# Altium schematic sheet STM32最小系统.SchDoc
size A3
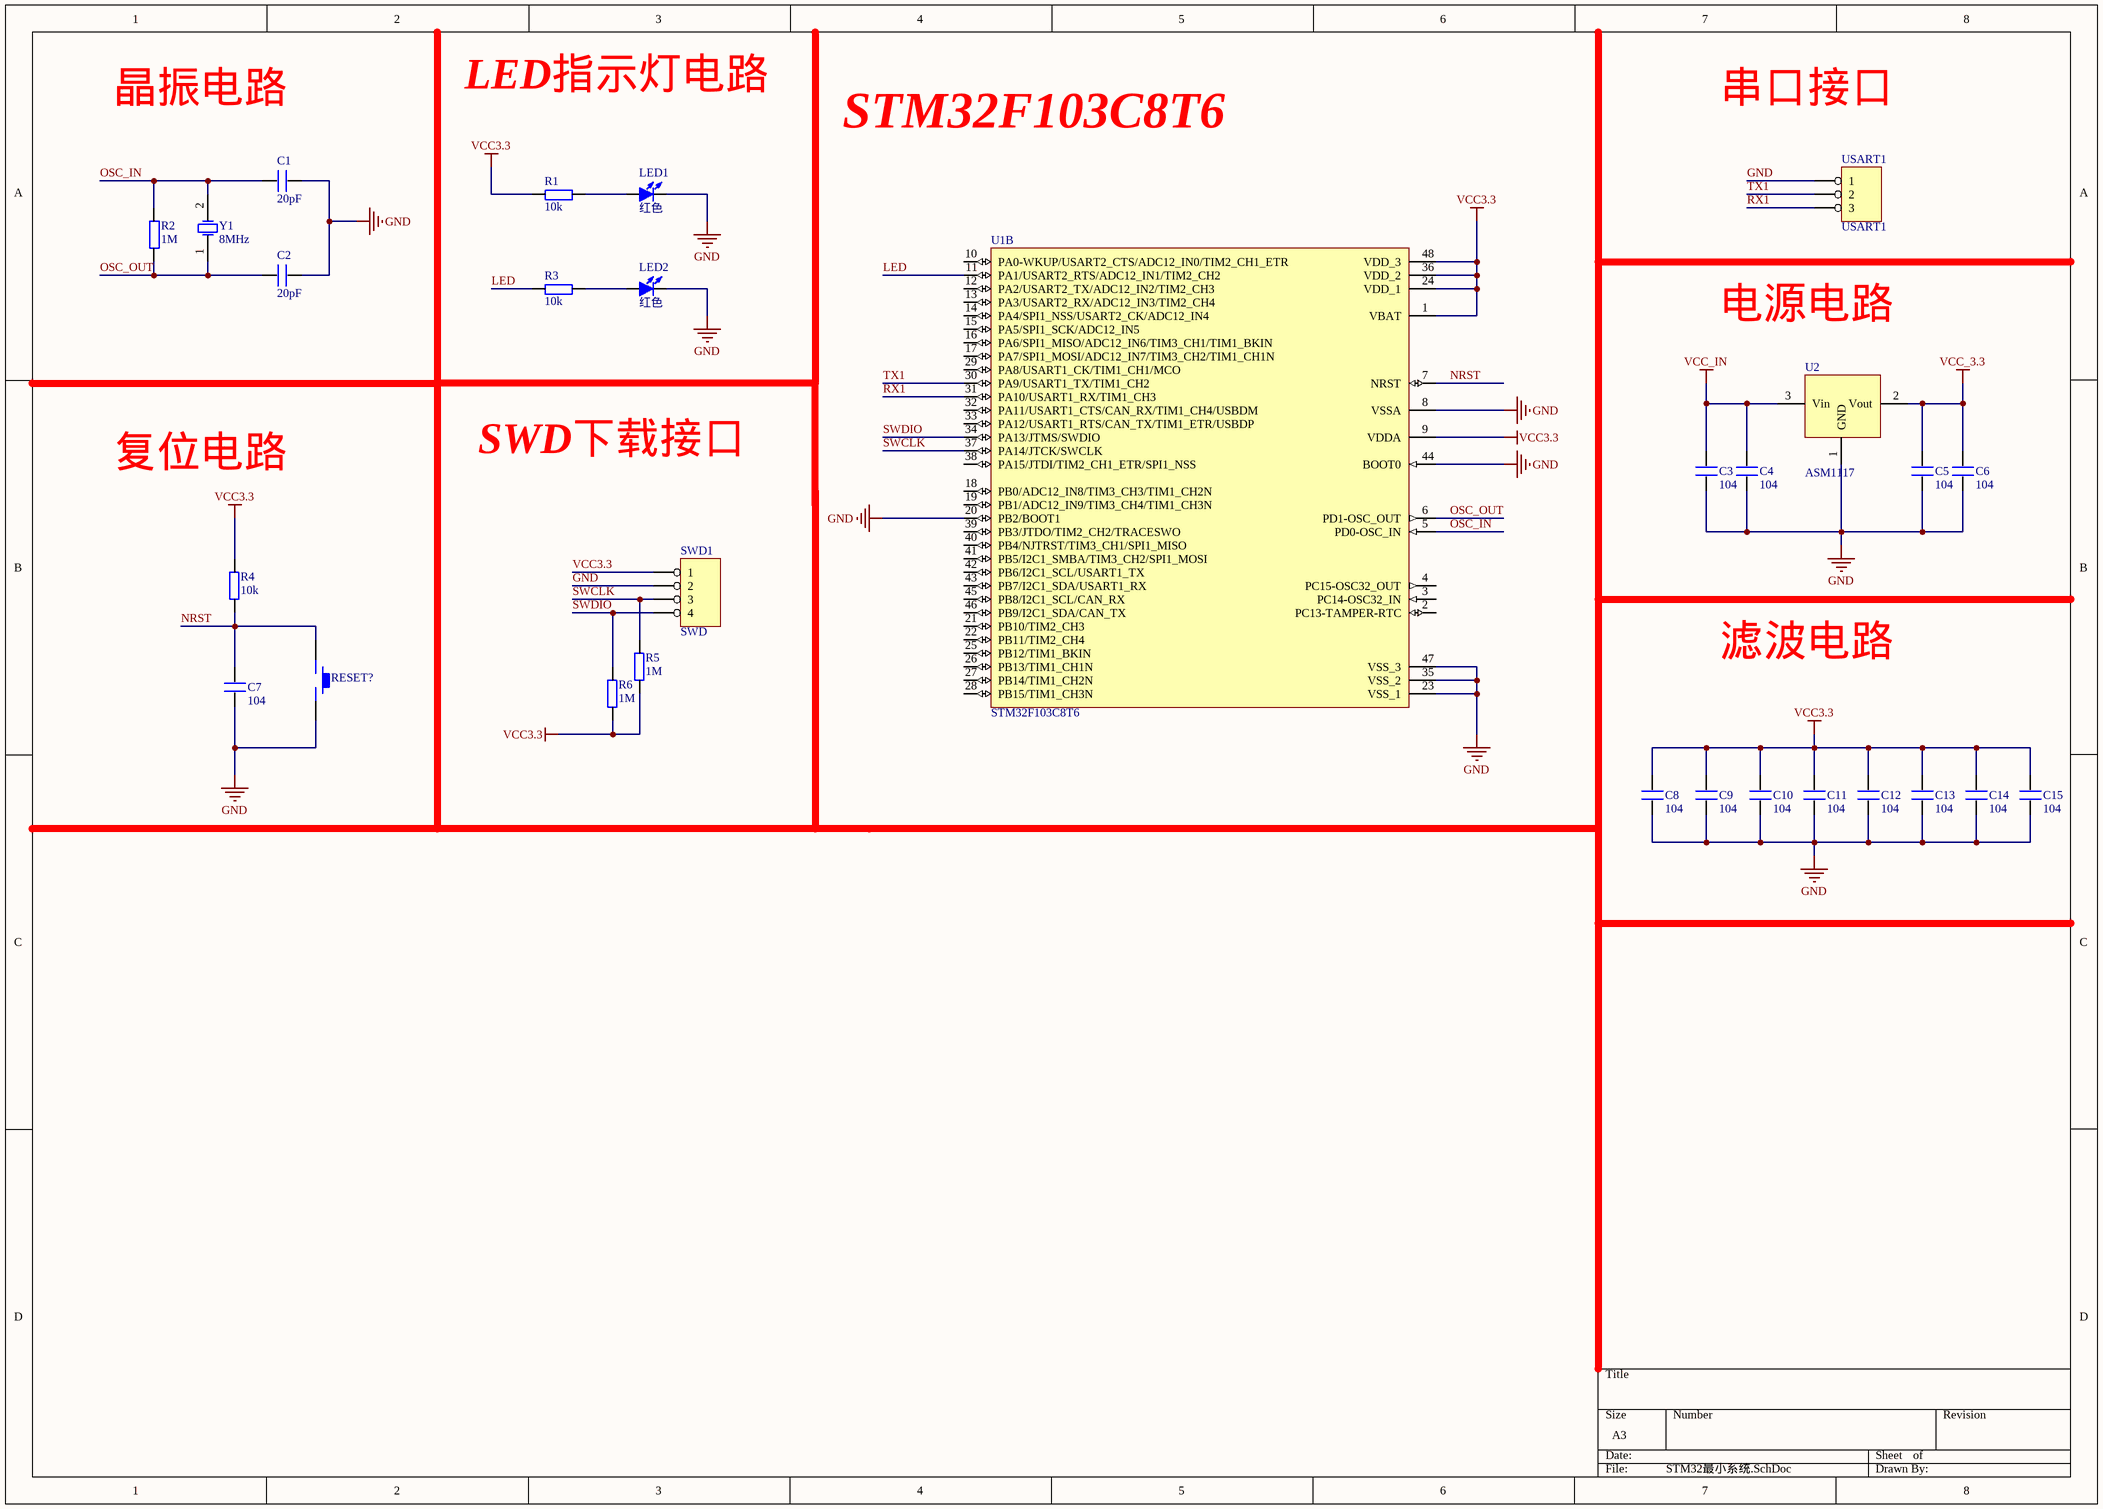
[diagram p0: STM32最小系统.SchDoc]

## Parts
C1  20pF  [0603P]
C2  20pF  [0603P]
C3  104  [0603P]
C4  104  [0603P]
C5  104  [0603P]
C6  104  [0603P]
C7  104  [0603P]
C8  104  [0603P]
C9  104  [0603P]
C10  104  [0603P]
C11  104  [0603P]
C12  104  [0603P]
C13  104  [0603P]
C14  104  [0603P]
C15  104  [0603P]
LED1  红色  [LED 3MM-B]
LED2  红色  [LED 3MM-B]
R1  10k  [0805]
R2  1M  [0805]
R3  10k  [0805]
R4  10k  [0805]
R5  1M  [0805]
R6  1M  [0805]
RESET?  KEY_M  [KEY_M]  (value not drawn)
SWD1  SWD  [SDW1]
U1  STM32F103C8T6  [LQFP48_N]  (part B of 2)
U2  ASM1117  [ASM1117]
USART1  USART1  [PCBComponent_1]
Y1  8MHz  [XTAL_US]

## Nets
GND: C1.2 C2.2 C3.1 C4.1 C5.1 C6.1 C7.1 C8.1 C9.1 C10.1 C11.1 C12.1 C13.1 C14.1 C15.1 LED1.2(K) LED2.2(K) RESET?.2 SWD1.?2(2) U1.8(VSSA) U1.20(PB2/BOOT1) U1.23(VSS_1) U1.35(VSS_2) U1.44(BOOT0) U1.47(VSS_3) U2.1(GND) USART1.?1(1)
VCC3.3: C8.2 C9.2 C10.2 C11.2 C12.2 C13.2 C14.2 C15.2 R1.1 R4.1 R5.2 R6.2 SWD1.?1(1) U1.1(VBAT) U1.9(VDDA) U1.24(VDD_1) U1.36(VDD_2) U1.48(VDD_3)
VCC_3.3: C5.2 C6.2 U2.2(Vout)
VCC_IN: C3.2 C4.2 U2.3(Vin)
LED: R3.1 U1.11(PA1/USART2_RTS/ADC12_IN1/TIM2_CH2)
NRST: C7.2 R4.2 RESET?.1 U1.7(NRST)
OSC_IN: C1.1 R2.2 U1.5(PD0-OSC_IN) Y1.2(OSC2)
OSC_OUT: C2.1 R2.1 U1.6(PD1-OSC_OUT) Y1.1(OSC1)
RX1: U1.31(PA10/USART1_RX/TIM1_CH3) USART1.?3(3)
SWCLK: R5.1 SWD1.?3(3) U1.37(PA14/JTCK/SWCLK)
SWDIO: R6.1 SWD1.?4(4) U1.34(PA13/JTMS/SWDIO)
TX1: U1.30(PA9/USART1_TX/TIM1_CH2) USART1.?2(2)
NetLED1_1: LED1.1(A) R1.2
NetLED2_1: LED2.1(A) R3.2

Not connected (* = marked no-connect by the designer): U1 2(PC13-TAMPER-RTC) 3(PC14-OSC32_IN) 4(PC15-OSC32_OUT) 10(PA0-WKUP/USART2_CTS/ADC12_IN0/TIM2_CH1_ETR) 12(PA2/USART2_TX/ADC12_IN2/TIM2_CH3) 13(PA3/USART2_RX/ADC12_IN3/TIM2_CH4) 14(PA4/SPI1_NSS/USART2_CK/ADC12_IN4) 15(PA5/SPI1_SCK/ADC12_IN5) 16(PA6/SPI1_MISO/ADC12_IN6/TIM3_CH1/TIM1_BKIN) 17(PA7/SPI1_MOSI/ADC12_IN7/TIM3_CH2/TIM1_CH1N) 18(PB0/ADC12_IN8/TIM3_CH3/TIM1_CH2N) 19(PB1/ADC12_IN9/TIM3_CH4/TIM1_CH3N) 21(PB10/TIM2_CH3) 22(PB11/TIM2_CH4) 25(PB12/TIM1_BKIN) 26(PB13/TIM1_CH1N) 27(PB14/TIM1_CH2N) 28(PB15/TIM1_CH3N) 29(PA8/USART1_CK/TIM1_CH1/MCO) 32(PA11/USART1_CTS/CAN_RX/TIM1_CH4/USBDM) 33(PA12/USART1_RTS/CAN_TX/TIM1_ETR/USBDP) 38(PA15/JTDI/TIM2_CH1_ETR/SPI1_NSS) 39(PB3/JTDO/TIM2_CH2/TRACESWO) 40(PB4/NJTRST/TIM3_CH1/SPI1_MISO) 41(PB5/I2C1_SMBA/TIM3_CH2/SPI1_MOSI) 42(PB6/I2C1_SCL/USART1_TX) 43(PB7/I2C1_SDA/USART1_RX) 45(PB8/I2C1_SCL/CAN_RX) 46(PB9/I2C1_SDA/CAN_TX)

## Notes on the sheet
- 晶振电路
- LED指示灯电路
- 串口接口
- STM32F103C8T6
- 电源电路
- 复位电路
- SWD下载接口
- 滤波电路

## Library data of the parts
C1-C15 = C
LED1 LED2 = LED-3MM: 插件LED; 版权归属: 源创客; BOM名称: 插件LED; 学习资源: www.ooocke.com
R1-R6 = R
Y1 = XTAL: Crystal Oscillator; Published: 8-Jun-2000; LatestRevisionDate: 17-Jul-2002; LatestRevisionNote: Re-released for DXP Platform.; Publisher: Altium Limited